# EAGLE design Etch_A_Sketch (EAGLE 9.6.2)
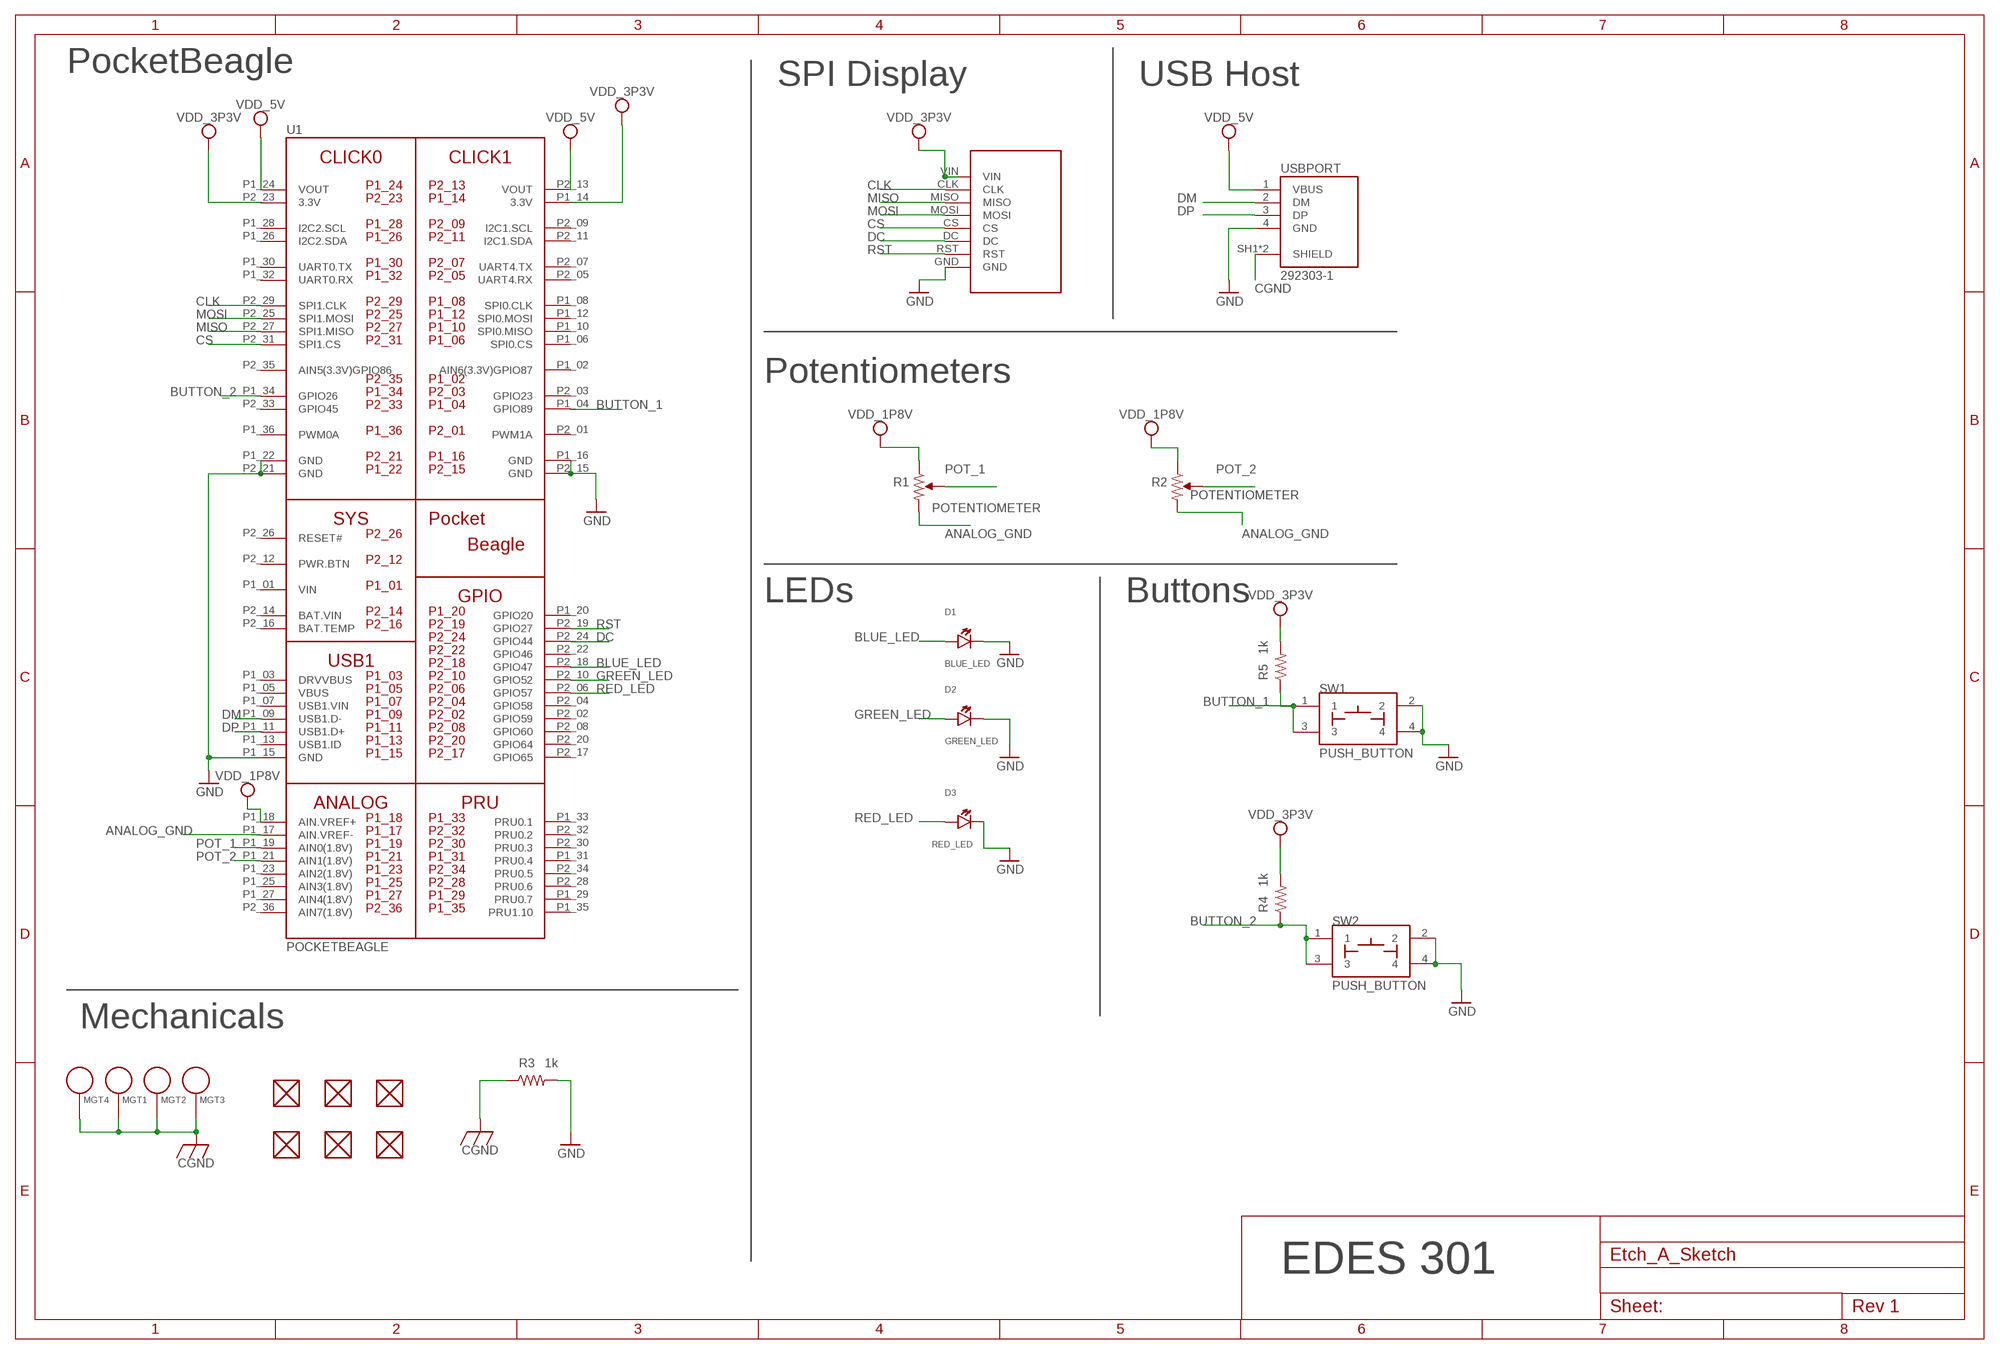
[diagram p0: schematic, sheet 1]

## Parts
D1  BLUE_LED  LED  [EIA-STD]
D2  GREEN_LED  LED  [EIA-STD]
D3  RED_LED  LED  [EIA-STD]
FUD1  FIDUCIAL  [FIDUCIAL_40MIL]
FUD2  FIDUCIAL  [FIDUCIAL_40MIL]
FUD3  FIDUCIAL  [FIDUCIAL_40MIL]
FUD4  FIDUCIAL  [FIDUCIAL_40MIL]
FUD5  FIDUCIAL  [FIDUCIAL_40MIL]
FUD6  FIDUCIAL  [FIDUCIAL_40MIL]
MGT1  MOUNTING_HOLE  [MOUNTING_HOLE]
MGT2  MOUNTING_HOLE  [MOUNTING_HOLE]
MGT3  MOUNTING_HOLE  [MOUNTING_HOLE]
MGT4  MOUNTING_HOLE  [MOUNTING_HOLE]
R1  POTENTIOMETER  [POT-PO90S]
R2  POTENTIOMETER  [POT-PO90S]
R3  1k  R_R0603  [R0603]
R4  1k  R_R0603  [R0603]
R5  1k  R_R0603  [R0603]
SPIDISPLAY  SCREEN  [SCREEN]
SW1  PUSH_BUTTON  [BUTTON_12.5MM]
SW2  PUSH_BUTTON  [BUTTON_12.5MM]
U1  POCKETBEAGLE  [POCKETBEAGLE]
USBPORT  292303-1  [TE_292303-1]

## Nets
ANALOG_GND: R1.CW R2.CW U1.P1_17(AIN.VREF-)
BLUE_LED: D1.ANODE U1.P2_18(GPIO47)
BUTTON_1: R5.1 SW1.1 SW1.3 U1.P1_04(GPIO89)
BUTTON_2: R4.1 SW2.1 SW2.3 U1.P1_34(GPIO26)
CGND: MGT1.P$1 MGT2.P$1 MGT3.P$1 MGT4.P$1 R3.1 USBPORT.SH1(SHIELD) USBPORT.SH2(SHIELD)
CLK: SPIDISPLAY.CLK U1.P2_29(SPI1.CLK)
CS: SPIDISPLAY.CS U1.P2_31(SPI1.CS)
DC: SPIDISPLAY.DC U1.P2_24(GPIO44)
DM: U1.P1_09(USB1.D-) USBPORT.2(DM)
DP: U1.P1_11(USB1.D+) USBPORT.3(DP)
GND: D1.CATHODE D2.CATHODE D3.CATHODE R3.2 SPIDISPLAY.GND SW1.2 SW1.4 SW2.2 SW2.4 U1.P1_15(GND) U1.P1_16(GND) U1.P1_22(GND) U1.P2_15(GND) U1.P2_21(GND) USBPORT.4(GND)
GREEN_LED: D2.ANODE U1.P2_10(GPIO52)
MISO: SPIDISPLAY.MISO U1.P2_27(SPI1.MISO)
MOSI: SPIDISPLAY.MOSI U1.P2_25(SPI1.MOSI)
POT_1: R1.S U1.P1_19(AIN0(1.8V))
POT_2: R2.S U1.P1_21(AIN1(1.8V))
RED_LED: D3.ANODE U1.P2_06(GPIO57)
RST: SPIDISPLAY.RST U1.P2_19(GPIO27)
VDD_1P8V: R1.CCW R2.CCW U1.P1_18(AIN.VREF+)
VDD_3P3V: R4.2 R5.2 SPIDISPLAY.VIN U1.P1_14(3.3V) U1.P2_23(3.3V)
VDD_5V: U1.P1_24(VOUT) U1.P2_13(VOUT) USBPORT.1(VBUS)
Unconnected: FUD1.P$1 FUD2.P$1 FUD3.P$1 FUD4.P$1 FUD5.P$1 FUD6.P$1 U1.P1_02(AIN6(3.3V)GPIO87) U1.P1_03(DRVVBUS) U1.P1_05(VBUS) U1.P1_06(SPI0.CS) U1.P1_07(USB1.VIN) U1.P1_08(SPI0.CLK) U1.P1_10(SPI0.MISO) U1.P1_12(SPI0.MOSI) U1.P1_13(USB1.ID) U1.P1_20(GPIO20) U1.P1_23(AIN2(1.8V)) U1.P1_25(AIN3(1.8V)) U1.P1_26(I2C2.SDA) U1.P1_27(AIN4(1.8V)) U1.P1_28(I2C2.SCL) U1.P1_29(PRU0.7) U1.P1_30(UART0.TX) U1.P1_31(PRU0.4) U1.P1_32(UART0.RX) U1.P1_33(PRU0.1) U1.P1_35(PRU1.10) U1.P1_36(PWM0A) U1.P2_01(PWM1A) U1.P2_02(GPIO59) U1.P2_03(GPIO23) U1.P2_04(GPIO58) U1.P2_05(UART4.RX) U1.P2_07(UART4.TX) U1.P2_08(GPIO60) U1.P2_09(I2C1.SCL) U1.P2_11(I2C1.SDA) U1.P2_12(PWR.BTN) U1.P2_16(BAT.TEMP) U1.P2_17(GPIO65) U1.P2_20(GPIO64) U1.P2_22(GPIO46) U1.P2_26(RESET#) U1.P2_28(PRU0.6) U1.P2_30(PRU0.3) U1.P2_32(PRU0.2) U1.P2_33(GPIO45) U1.P2_34(PRU0.5) U1.P2_35(AIN5(3.3V)GPIO86) U1.P2_36(AIN7(1.8V))

## Notes on the sheet
- PocketBeagle
- SPI Display | USB Host
- Potentiometers
- LEDs | Buttons
- Mechanicals
- EDES 301

## Power pins joined to a net without a drawn wire
BAT.VIN: U1.P2_14(BAT.VIN)
VIN: U1.P1_01(VIN)

## Library data of the parts
D1-D3 = Etch_A_Sketch:LED: EIA-STD LED, LTST-C191TBKT
FUD1-FUD6 = Etch_A_Sketch:FIDUCIAL
MGT1-MGT4 = Etch_A_Sketch:MOUNTING_HOLE: Chassis Mounting Hole w/GND connection ability
R1 R2 = Etch_A_Sketch:POTENTIOMETER: Potentiometer - Examples: P090S-14T20BR10K (987-1277-ND)
R3-R5 = Etch_A_Sketch:R_: RESISTOR, American symbol
SPIDISPLAY = Etch_A_Sketch:SCREEN
SW1 SW2 = Etch_A_Sketch:PUSH_BUTTON
U1 = Etch_A_Sketch:POCKETBEAGLE
USBPORT = Etch_A_Sketch:292303-1: CONN USB RECEPT R/A TYPE A 4POS Check availability <https://pricing.snapeda.com/parts/292303-1/TE%20Connectivity/view-part?ref=eda>; AVAILABILITY: In Stock; CENTERLINE_PITCH: 2 mm[.078 in]; COMMENT: 292303-1; DESCRIPTION: Conn; Data; USB; Recept; 2.0; 4 Pos; 1 Port; Rt Angle; A Ser; Tin over Copper; EU_ROHS_COMPLIANCE: Compliant; MF: TE Connectivity; MP: 292303-1; NUMBER_OF_POSITIONS: 4; PACKAGE: None; PRICE: None; PRODUCT_TYPE: Connector; PURCHASE-URL: https://pricing.snapeda.com/search/part/292303-1/?ref=eda

## Board
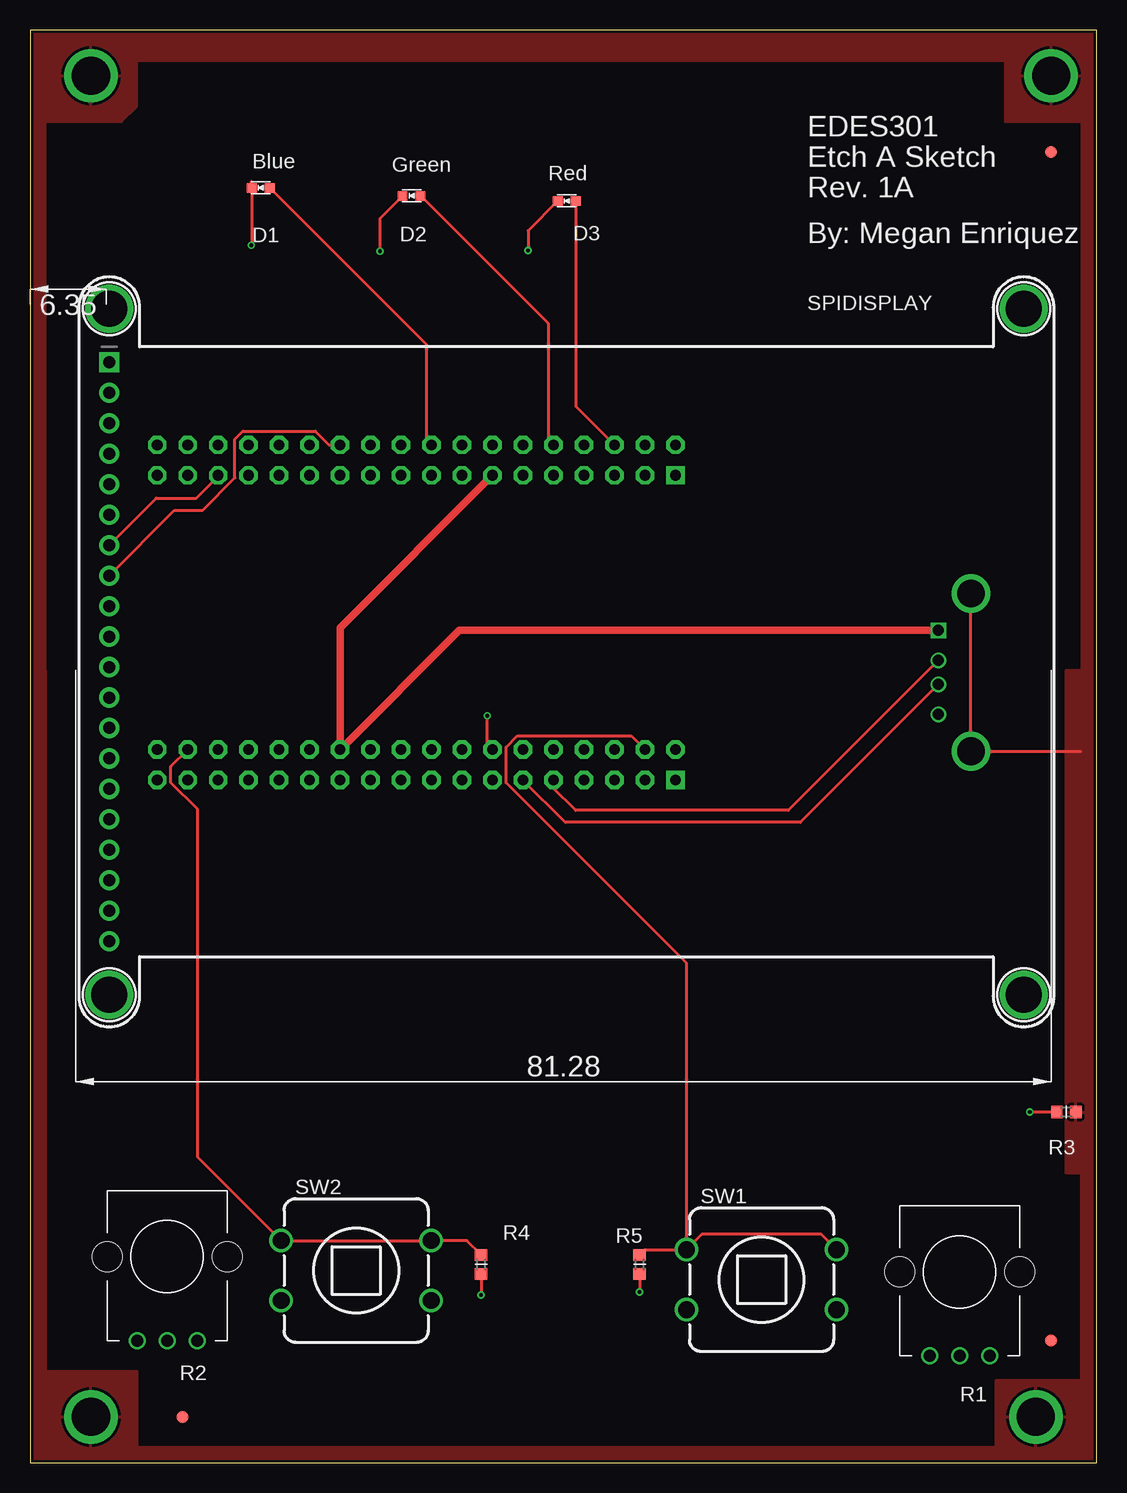
[diagram p1: board, top side]
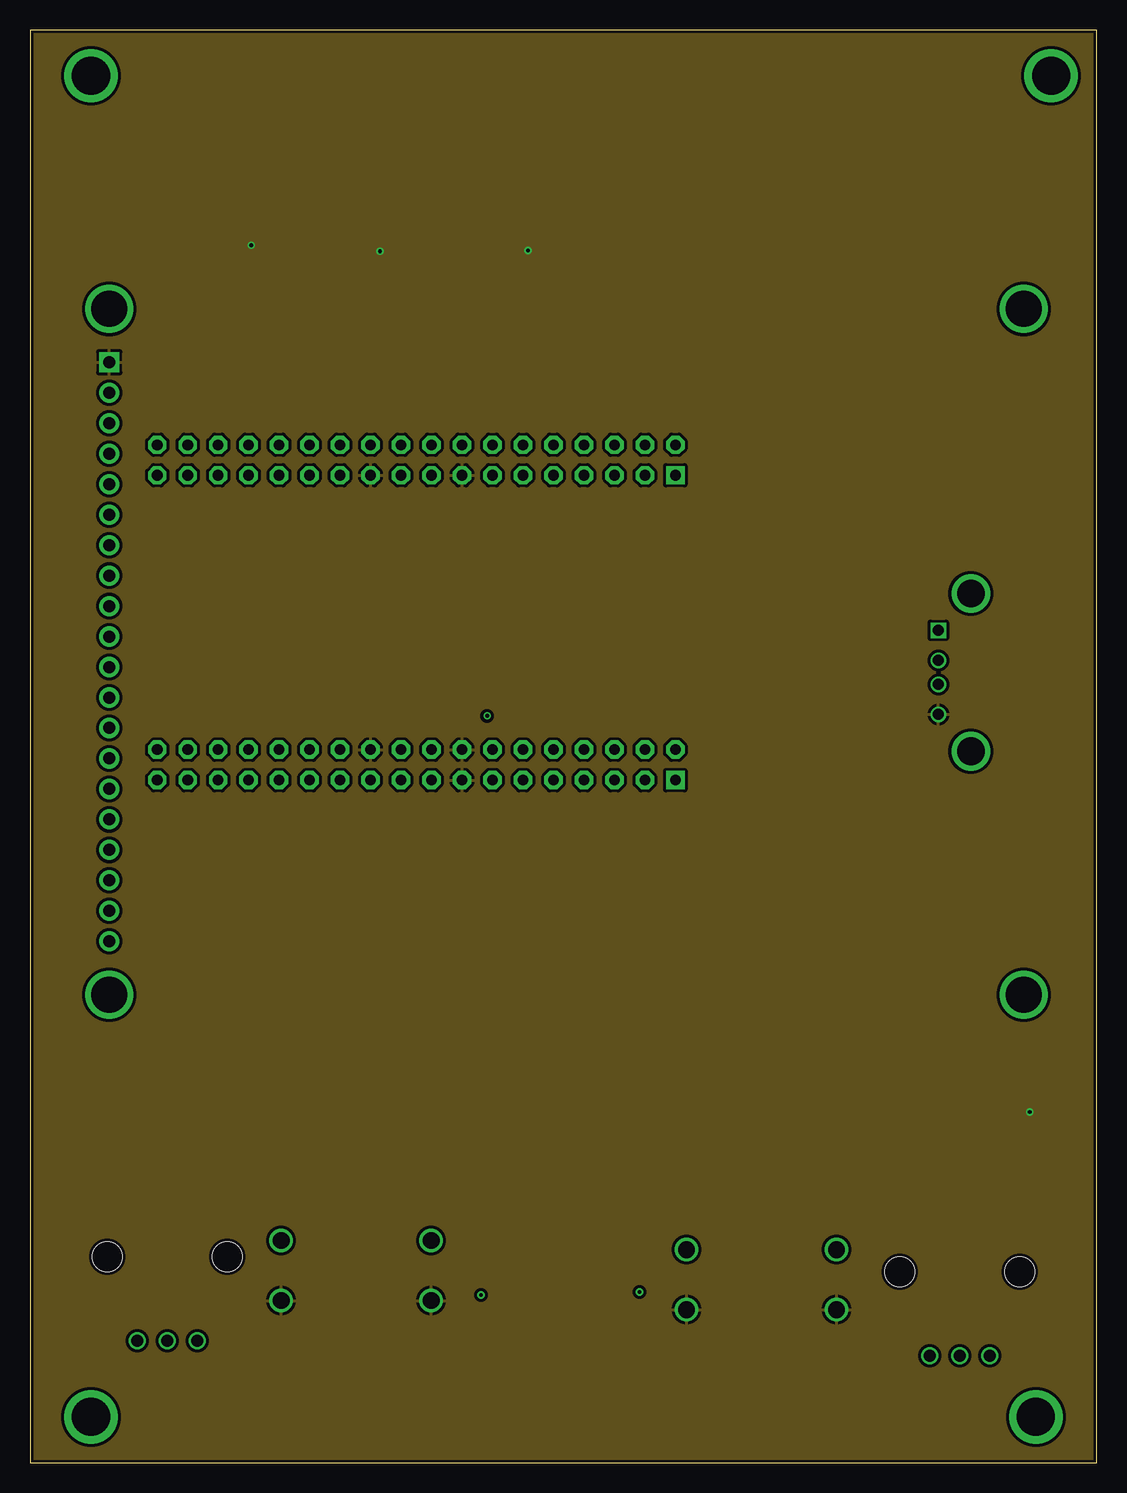
[diagram p2: board, inner layer Route2]
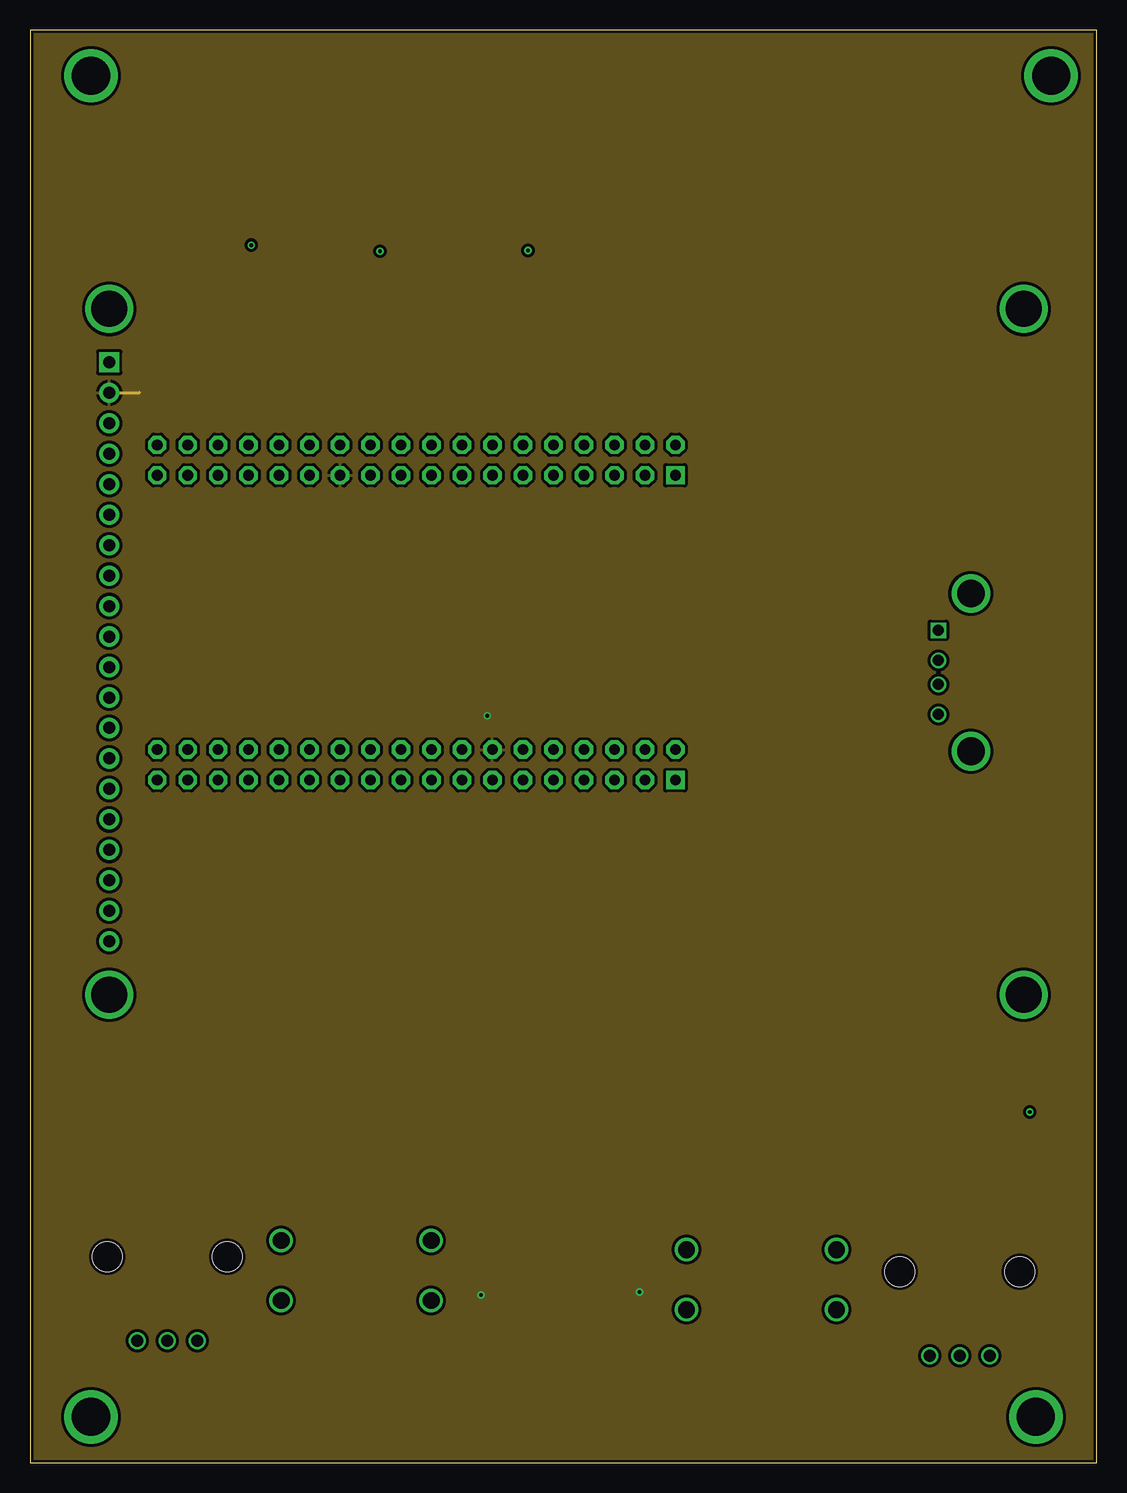
[diagram p3: board, inner layer Route15]
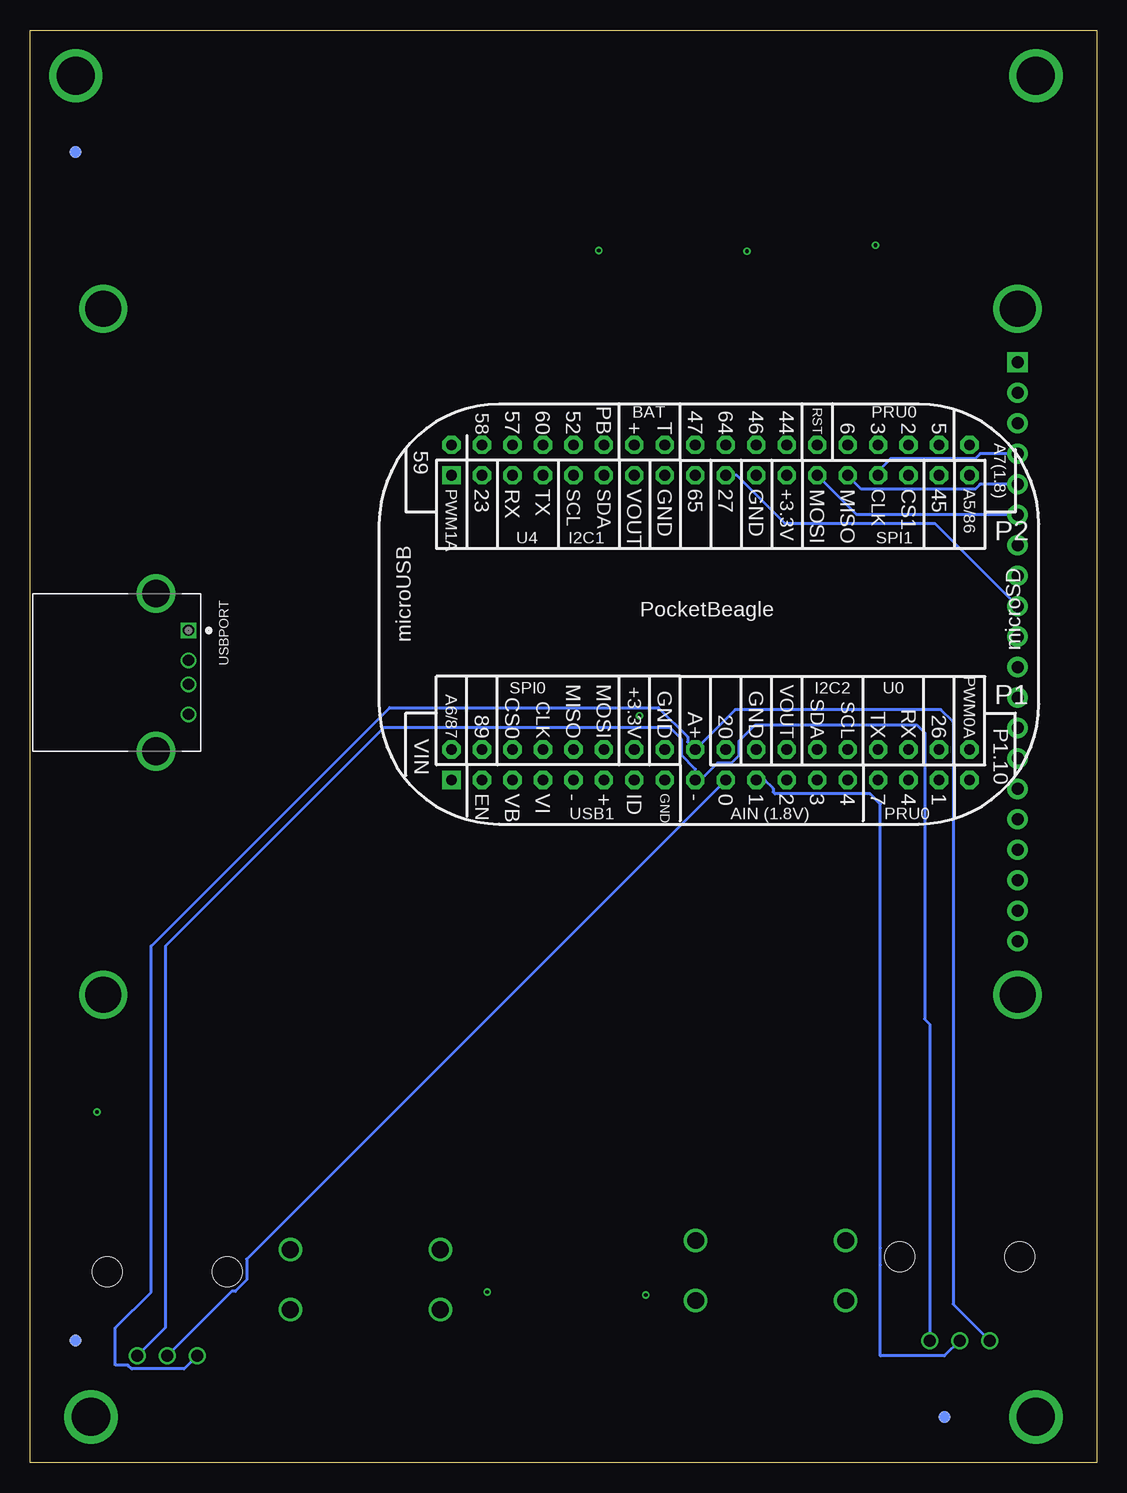
[diagram p4: board, bottom side, seen from below]

Size 88.9 x 119.38 mm. Coordinates in mm from the lower left corner, seen from the top.
Outline: 0,0 88.9,0 88.9,119.38 0,119.38 0,0
Copper layers (1*2*15*16): Top 0.035mm / dielectric 0.23mm / Route2 0.035mm / dielectric 0.93mm / Route15 0.035mm / dielectric 0.23mm / Bottom 0.035mm
Design rules "EDES301_4lyr": minimum track width 10mil, minimum drill 12mil, track to track 10mil, track to pad 10mil, pad to pad 10mil, via to via 10mil, smd to smd 10mil, copper to edge 10mil, drill to drill 12mil, minimum pad ring 6mil, minimum via ring 6mil, stop-mask expansion 3mil, vias tented up to drill 25mil, thermal gap 10mil

### Footprints (pad centres in the part's own frame; a part is rotated, then mirrored left to right if it is on the bottom)
EIA-STD = smd 0.8 x 0.8: ANODE -0.75,0; CATHODE 0.75,0
FIDUCIAL_40MIL = smd 1.016 x 1.016: P$1 0,0
MOUNTING_HOLE = drill 3.175 pad 4.445: P$1 0,0
POT-PO90S = drill 1: CCW -2.5,0; CW 2.5,0; S 0,0 | hole 2.5: -5,7; 5,7
R0603 = smd 0.95 x 1.031: 1 -0.8,0; 2 0.8,0
SCREEN = drill 1 pad 1.676: 3VO -19.05,-38.1; 12@JP2 3.81,-38.1; 13@JP2 6.35,-38.1; 14@JP2 8.89,-38.1; 15@JP2 11.43,-38.1; 16@JP2 13.97,-38.1; 17@JP2 16.51,-38.1; 18@JP2 19.05,-38.1; 19@JP2 21.59,-38.1; 20@JP2 24.13,-38.1; CLK -16.51,-38.1; CS -8.89,-38.1; DC -6.35,-38.1; GND@1 1.27,-38.1; LITE -1.27,-38.1; MISO -13.97,-38.1; MOSI -11.43,-38.1; RST -3.81,-38.1; VIN -21.59,-38.1 | drill 1 pad 1.676 square: GND -24.13,-38.1 | drill 3 pad 3.6: P$1@U$7 -28.575,-38.1; P$1@U$15 28.575,-38.1; P$1@U$16 -28.575,38.1; P$1@U$17 28.575,38.1
BUTTON_12.5MM = drill 1.4: 1 -6.25,2.5; 2 -6.25,-2.5; 3 6.25,2.5; 4 6.25,-2.5
POCKETBEAGLE = drill 0.889 pad 1.524 square: P1_01 5.91,3.53; P2_01 5.91,28.93 | drill 0.889 pad 1.524 octagon: P1_02 5.91,6.07; P1_03 8.45,3.53; P1_04 8.45,6.07; P1_05 10.99,3.53; P1_06 10.99,6.07; P1_07 13.53,3.53; P1_08 13.53,6.07; P1_09 16.07,3.53; P1_10 16.07,6.07; P1_11 18.61,3.53; P1_12 18.61,6.07; P1_13 21.15,3.53; P1_14 21.15,6.07; P1_15 23.69,3.53; P1_16 23.69,6.07; P1_17 26.23,3.53; P1_18 26.23,6.07; P1_19 28.77,3.53; P1_20 28.77,6.07; P1_21 31.31,3.53; P1_22 31.31,6.07; P1_23 33.85,3.53; P1_24 33.85,6.07; P1_25 36.39,3.53; P1_26 36.39,6.07; P1_27 38.93,3.53; P1_28 38.93,6.07; P1_29 41.47,3.53; P1_30 41.47,6.07; P1_31 44.01,3.53; P1_32 44.01,6.07; P1_33 46.55,3.53; P1_34 46.55,6.07; P1_35 49.09,3.53; P1_36 49.09,6.07; P2_02 5.91,31.47; P2_03 8.45,28.93; P2_04 8.45,31.47; P2_05 10.99,28.93; P2_06 10.99,31.47; P2_07 13.53,28.93; P2_08 13.53,31.47; P2_09 16.07,28.93; P2_10 16.07,31.47; P2_11 18.61,28.93; P2_12 18.61,31.47; P2_13 21.15,28.93; P2_14 21.15,31.47; P2_15 23.69,28.93; P2_16 23.69,31.47; P2_17 26.23,28.93; P2_18 26.23,31.47; P2_19 28.77,28.93; P2_20 28.77,31.47; P2_21 31.31,28.93; P2_22 31.31,31.47; P2_23 33.85,28.93; P2_24 33.85,31.47; P2_25 36.39,28.93; P2_26 36.39,31.47; P2_27 38.93,28.93; P2_28 38.93,31.47; P2_29 41.47,28.93; P2_30 41.47,31.47; P2_31 44.01,28.93; P2_32 44.01,31.47; P2_33 46.55,28.93; P2_34 46.55,31.47; P2_35 49.09,28.93; P2_36 49.09,31.47
TE_292303-1 = drill 0.92 square: 1 0,0 | drill 0.92: 2 2.5,0; 3 4.5,0; 4 7,0 | drill 2.3: SH1 -3.07,-2.71; SH2 10.07,-2.71

### Placement (x,y rotation side)
D1  19.23,106.22 180 top
D2  31.8,105.56 180 top
D3  44.73,105.13 180 top
FUD1  12.7,3.81 0 top
FUD2  85.09,10.16 0 top
FUD3  85.09,109.22 0 top
FUD4  85.09,10.16 0 bottom
FUD5  12.7,3.81 0 bottom
FUD6  85.09,109.22 0 bottom
MGT1  85.09,115.57 0 top
MGT2  83.82,3.81 0 top
MGT3  5.08,3.81 0 top
MGT4  5.08,115.57 0 top
R1  77.47,8.89 0 top
R2  11.43,10.16 0 top
R3  86.36,29.21 180 top
R4  37.59,16.51 270 top
R5  50.8,16.51 270 top
SPIDISPLAY  44.7,67.56 270 top
SW1  60.96,15.24 0 top
SW2  27.18,16 0 top
U1  59.69,53.34 0 bottom
USBPORT  75.69,69.34 270 bottom

### Tracks (layer width: path | path; a pad name or v marks a point on that pad's centre or on a via)
ANALOG_GND
  Bottom 0.254: R2.CW 13.93,36.54 14.35,36.96 14.35,60.81 15.01,61.47 28.45,61.47 29.78,60.14 29.78,58.94 30.45,58.27 31.65,58.27 33.04,56.87 U1.P1_17 33.46,57.79 34.6,58.94 34.6,60.26 35.56,61.21 59.44,61.21 77.62,43.03 77.62,11.24 R1.CW
BLUE_LED
  Top 0.254: D1.ANODE 33.02,93.18 33.02,85.09 33.3,84.81 U1.P2_18
BUTTON_1
  Top 0.254: SW1.3 65.94,19.01 55.98,19.01 SW1.1 | R5.1 51.23,17.74 SW1.1 | SW1.1 54.71,41.62 39.68,56.65 39.68,59.63 40.61,60.55 50.1,60.55 U1.P1_04
BUTTON_2
  Top 0.254: R4.1 36.4,18.5 SW2.3 SW2.1 13.97,25.46 13.97,54.42 11.74,56.65 11.74,58.01 U1.P1_34
CGND
  Top 0.254: USBPORT.SH1 USBPORT.SH2 87.54,59.27
  pour Top: -3.81,66.04 1.27,66.04 1.27,7.62 8.89,7.62 8.89,1.27 80.52,1.27 80.52,6.86 87.63,6.86 87.63,24.13 86.36,24.13 86.36,66.04 91.44,66.04 91.44,-2.54 -1.27,-2.54 -3.81,0
  pour Top: 1.27,66.04 1.27,111.76 7.62,111.76 8.89,113.03 8.89,116.84 81.28,116.84 81.28,111.76 87.63,111.76 87.63,66.04 91.44,66.04 91.44,121.92 -1.27,121.92 -2.54,120.65 -2.54,66.04
CLK
  Bottom 0.254: SPIDISPLAY.CLK 9.72,84.07 10.13,83.67 17.17,83.67 18.22,82.62 U1.P2_29
CS
  Top 0.254: U1.P2_31 15.68,82.18 13.87,80.36 10.52,80.36 SPIDISPLAY.CS
DC
  Top 0.254: SPIDISPLAY.DC 12.04,79.35 14.38,79.35 17.08,82.05 17.08,85.28 17.75,85.95 23.77,85.95 24.92,84.81 U1.P2_24
DM
  Top 0.254: USBPORT.2 63.21,54.36 45.47,54.36 43.62,56.2 U1.P1_09
DP
  Top 0.254: USBPORT.3 64.19,53.34 44.61,53.34 U1.P1_11
GND  (via drill 0.3 pad 0.61)
  Top 0.254: 18.48,106.74 D1.CATHODE 18.48,101.48 v18.44,101.45 | R3.2 v83.31,29.21 | D2.CATHODE 29.16,103.67 v29.16,100.94 | D3.CATHODE 41.5,102.66 v41.5,101.02
  pour Route2: -5.08,-5.08 -5.08,124.46 93.98,124.46 93.98,-5.08
GREEN_LED
  Top 0.254: D2.ANODE 43.18,94.93 43.18,85.09 43.46,84.81 U1.P2_10
MISO
  Bottom 0.254: SPIDISPLAY.MISO 9.72,81.53 10.13,81.13 19.62,81.13 U1.P2_27
MOSI
  Bottom 0.254: SPIDISPLAY.MOSI 20.02,78.99 U1.P2_25
POT_1
  Bottom 0.254: U1.P1_19 70.84,16.95 70.84,15.21 71.79,14.26 72.1,14.26 R1.S
POT_2
  Bottom 0.254: R2.S 12.7,8.89 18.03,8.89 18.03,16.46 18.06,16.48 18.06,17.84 18.03,17.86 18.03,54.86 18.9,55.73 26.82,55.73 26.97,55.88 26.97,56.18 27.66,56.87 U1.P1_21
RED_LED
  Top 0.254: U1.P2_06 45.48,88.03 D3.ANODE
RST
  Bottom 0.254: SPIDISPLAY.RST 13.46,78.23 25.96,78.23 30,82.27 U1.P2_19
VDD_1P8V
  Bottom 0.254: R2.CCW 11.98,13.21 11.98,61.72 12.99,62.74 30.13,62.74 30.89,61.98 30.94,61.93 U1.P1_18 34.09,60.05 34.09,60.47 36.54,62.92 58.92,62.92 78.81,43.03 78.81,14.2 81.79,11.22 81.79,8.13 80.74,8.13 80.42,7.81 76.05,7.81 R1.CCW
VDD_3P3V  (via drill 0.3 pad 0.61)
  Top 0.254: 37.59,15.78 R4.2 v37.59,13.97 | U1.P1_14 38.1,59.85 v38.1,62.23 | R5.2 v50.8,14.22
  Route15 0.254: SPIDISPLAY.VIN 9.14,89.15
  pour Route15: -7.62,-7.62 -7.62,127 96.52,127 96.52,-7.62
VDD_5V
  Top 0.61: U1.P2_13 25.84,69.57 U1.P1_24 35.77,69.34 USBPORT.1

### Text on the board
tNames: EDES301 | Blue | Green | Etch A Sketch | Red | Rev. 1A | By: Megan Enriquez
201bmp: C:/Users/Megan/Downloads/etch-a-sketch.bmp